# EAGLE design THTfeather (EAGLE 7.6.0)
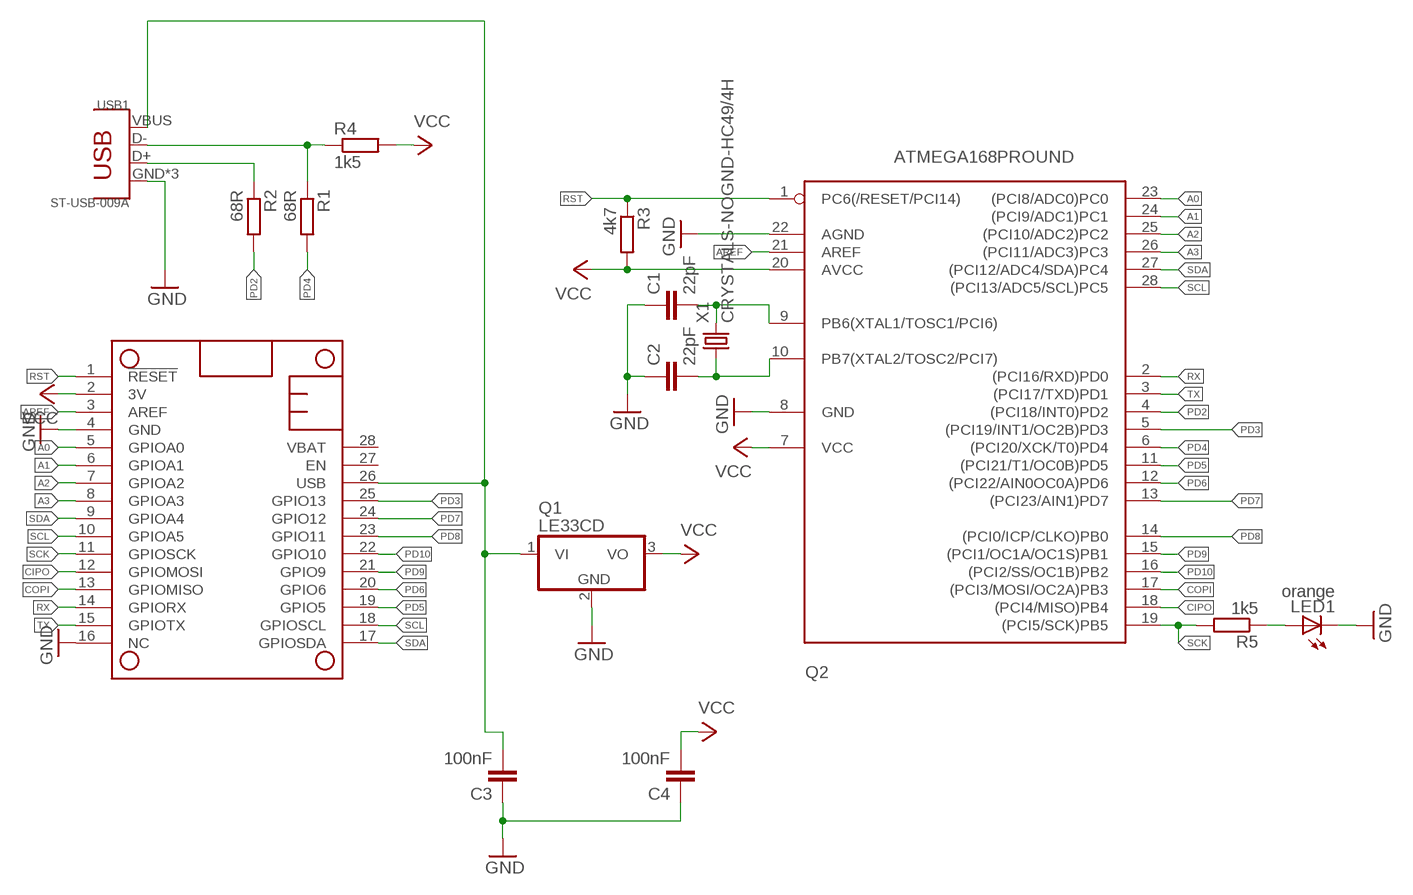
[diagram p0: schematic, sheet 1]

## Parts
C1  22pF  C-EU025-025X050  [C025-025X050]
C2  22pF  C-EU025-025X050  [C025-025X050]
C3  100nF  C-EU025-025X050  [C025-025X050]
C4  100nF  C-EU025-025X050  [C025-025X050]
LED1  orange  LED3MM  [LED3MM]
MS1  FEATHERWING_NODIM  [FEATHERWING_DIM]
Q1  LE33CD  78L33  [TO92]
Q2  ATMEGA168PROUND  [DIL28-3-ROUND]
R1  68R  R-EU_0204/5  [0204/5]
R2  68R  R-EU_0204/5  [0204/5]
R3  4k7  R-EU_0204/5  [0204/5]
R4  1k5  R-EU_0204/5  [0204/5]
R5  1k5  R-EU_0204/5  [0204/5]
USB1  ST-USB-009A  DIP-USB-B-TYPE-FMAL(4+2P-2.5-90D)  [USB4+2-2.5-90D]
X1  CRYSTALS-NOGND-HC49/4H  [HC49]

## Nets
A0: MS1.5(GPIOA0) Q2.23((PCI8/ADC0)PC0)
A1: MS1.6(GPIOA1) Q2.24((PCI9/ADC1)PC1)
A2: MS1.7(GPIOA2) Q2.25((PCI10/ADC2)PC2)
A3: MS1.8(GPIOA3) Q2.26((PCI11/ADC3)PC3)
AREF: MS1.3(AREF) Q2.21(AREF)
CIPO: MS1.12(GPIOMOSI) Q2.18((PCI4/MISO)PB4)
COPI: MS1.13(GPIOMISO) Q2.17((PCI3/MOSI/OC2A)PB3)
GND: C1.1 C2.1 C3.1 C4.1 LED1.K(C) MS1.4(GND) MS1.16(NC) Q1.2(GND) Q2.8(GND) Q2.22(AGND) USB1.GND USB1.S1 USB1.S2
N$1: C1.2 Q2.9(PB6(XTAL1/TOSC1/PCI6)) X1.2
N$2: C2.2 Q2.10(PB7(XTAL2/TOSC2/PCI7)) X1.1
N$4: LED1.A R5.1
N$5: R1.1 R4.1 USB1.D-
N$6: R2.1 USB1.D+
PD2: Q2.4((PCI18/INT0)PD2) R2.2
PD3: MS1.25(GPIO13) Q2.5((PCI19/INT1/OC2B)PD3)
PD4: Q2.6((PCI20/XCK/T0)PD4) R1.2
PD5: MS1.19(GPIO5) Q2.11((PCI21/T1/OC0B)PD5)
PD6: MS1.20(GPIO6) Q2.12((PCI22/AIN0OC0A)PD6)
PD7: MS1.24(GPIO12) Q2.13((PCI23/AIN1)PD7)
PD8: MS1.23(GPIO11) Q2.14((PCI0/ICP/CLKO)PB0)
PD9: MS1.21(GPIO9) Q2.15((PCI1/OC1A/OC1S)PB1)
PD10: MS1.22(GPIO10) Q2.16((PCI2/SS/OC1B)PB2)
RST: MS1.1(!RESET) Q2.1(PC6(/RESET/PCI14)) R3.1
RX: MS1.14(GPIORX) Q2.2((PCI16/RXD)PD0)
SCK: MS1.11(GPIOSCK) Q2.19((PCI5/SCK)PB5) R5.2
SCL: MS1.10(GPIOA5) MS1.18(GPIOSCL) Q2.28((PCI13/ADC5/SCL)PC5)
SDA: MS1.9(GPIOA4) MS1.17(GPIOSDA) Q2.27((PCI12/ADC4/SDA)PC4)
TX: MS1.15(GPIOTX) Q2.3((PCI17/TXD)PD1)
USB: C3.2 MS1.26(USB) Q1.1(VI) USB1.VBUS
VCC: C4.2 MS1.2(3V) Q1.3(VO) Q2.7(VCC) Q2.20(AVCC) R3.2 R4.2
Unconnected: MS1.27(EN) MS1.28(VBAT)

## Library data of the parts
C1-C4 = rcl:C-EU: CAPACITOR, European symbol
LED1 = led:LED: LED OSRAM: - CHIPLED LG R971, LG N971, LY N971, LG Q971, LY Q971, LO R971, LY R971 LH N974, LH R974 LS Q976, LO Q976, LY Q976 LO Q996 - Hyper CHIPLED LW Q18S LB Q993, LB Q99A, LB R99A - SideLED LS A670, LO A670, LY A670, LG A670, LP A670 LB A673, LV A673, LT A673, LW A673 LH A674 LY A675 LS A676, LA A676, LO A676, LY A676, LW A676 LS A679, LY A679, LG A679 - Hyper Micro SIDELED® LS Y876, LA Y876, LO Y876, LY Y876 LT Y87S - SmartLED LW L88C, LW L88S LB L89C, LB L89S, LG L890 LS L89K, LO L89K, LY L89K LS L896, LA L896, LO L896, LY L896 - TOPLED LS T670, LO T670, LY T670, LG T670, LP T670 LSG T670, LSP T670, LSY T670, LOP T670, LYG T670 LG T671, LOG T671, LSG T671 LB T673, LV T673, LT T673, LW T673 LH T674 LS T676, LA T676, LO T676, LY T676, LB T676, LH T676, LSB T676, LW T676 LB T67C, LV T67C, LT T67C, LS T67K, LO T67K, LY T67K, LW E67C LS E67B, LA E67B, LO E67B, LY E67B, LB E67C, LV E67C, LT E67C LW T67C LS T679, LY T679, LG T679 LS T770, LO T770, LY T770, LG T770, LP T770 LB T773, LV T773, LT T773, LW T773 LH T774 LS E675, LA E675, LY E675, LS T675 LS T776, LA T776, LO T776, LY T776, LB T776 LHGB T686 LT T68C, LB T68C - Hyper Mini TOPLED® LB M676 - Mini TOPLED Santana® LG M470 LS M47K, LO M47K, LY M47K Source: http://www.osram.convergy.de LUXEON: - LUMILED® LXK2-PW12-R00, LXK2-PW12-S00, LXK2-PW14-U00, LXK2-PW14-V00 LXK2-PM12-R00, LXK2-PM12-S00, LXK2-PM14-U00 LXK2-PE12-Q00, LXK2-PE12-R00, LXK2-PE12-S00, LXK2-PE14-T00, LXK2-PE14-U00 LXK2-PB12-K00, LXK2-PB12-L00, LXK2-PB12-M00, LXK2-PB14-N00, LXK2-PB14-P00, LXK2-PB14-Q00 LXK2-PR12-L00, LXK2-PR12-M00, LXK2-PR14-Q00, LXK2-PR14-R00 LXK2-PD12-Q00, LXK2-PD12-R00, LXK2-PD12-S00 LXK2-PH12-R00, LXK2-PH12-S00 LXK2-PL12-P00, LXK2-PL12-Q00, LXK2-PL12-R00 Source: www.luxeon.com KINGBRIGHT: KA-3528ASYC Source: www.kingbright.com
MS1 = adafruit:FEATHERWING
Q1 = adafruit:78L33
Q2 = adafruit:ATMEGA168*P: MICROCONTROLLER 16 kBytes FLASH 1 kBytes SRAM 512 Bytes EEPROM USART 8-channel 10 bit ADC
R1-R5 = rcl:R-EU_: RESISTOR, European symbol
USB1 = Seeed-OPL-Connector:DIP-USB-B-TYPE-FMAL(4+2P-2.5-90D): 320010018; MPN: ST-USB-009A
X1 = IQD-Frequency-Products:CRYSTALS-NOGND: CRYSTALS CAN NOT GROUNDED

## Board
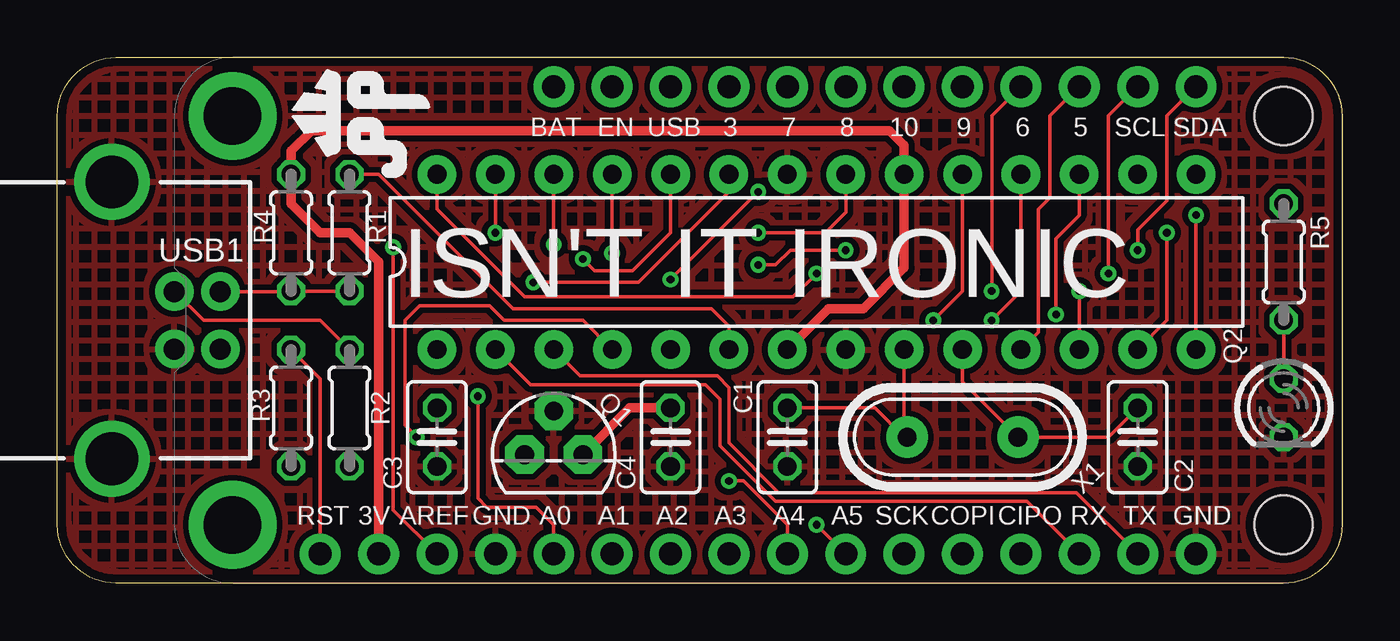
[diagram p1: board, top side]
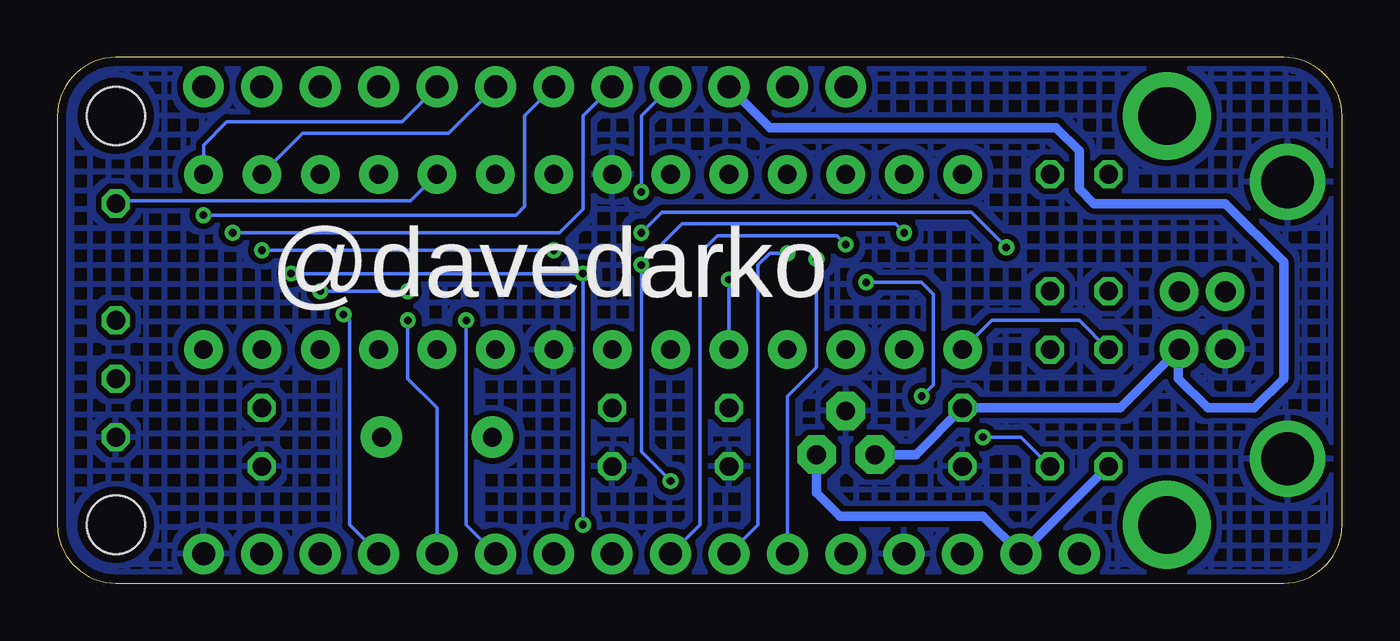
[diagram p2: board, bottom side, seen from below]

Size 55.88 x 22.86 mm. Coordinates in mm from the lower left corner, seen from the top.
Outline: 55.88,20.32 55.88,2.54 arc-90 53.34,0 2.54,0 arc-90 0,2.54 0,20.32 arc-90 2.54,22.86 53.34,22.86 arc-90 55.88,20.32
Copper layers (1*16): Top 0.0356mm / dielectric 1.5011mm / Bottom 0.0356mm
Design rules "LaenPCBOrder *": minimum track width 6mil, minimum drill 13mil, track to track 6mil, track to pad 6mil, pad to pad 6mil, via to via 6mil, smd to smd 6mil, copper to edge 15mil, drill to drill 6mil, minimum pad ring 7mil, minimum via ring 7mil, stop-mask expansion 3mil, vias tented up to drill 200mil, thermal gap 10mil

### Footprints (pad centres in the part's own frame; a part is rotated, then mirrored left to right if it is on the bottom)
C025-025X050 = drill 0.813 octagon: 1 -1.27,0; 2 1.27,0
LED3MM = drill 0.813 octagon: A -1.27,0; K 1.27,0
FEATHERWING_DIM = drill 1 pad 1.778: 1 6.35,1.27; 2 8.89,1.27; 3 11.43,1.27; 4 13.97,1.27; 5 16.51,1.27; 6 19.05,1.27; 7 21.59,1.27; 8 24.13,1.27; 9 26.67,1.27; 10 29.21,1.27; 11 31.75,1.27; 12 34.29,1.27; 13 36.83,1.27; 14 39.37,1.27; 15 41.91,1.27; 16 44.45,1.27; 17 44.45,21.59; 18 41.91,21.59; 19 39.37,21.59; 20 36.83,21.59; 21 34.29,21.59; 22 31.75,21.59; 23 29.21,21.59; 24 26.67,21.59; 25 24.13,21.59; 26 21.59,21.59; 27 19.05,21.59; 28 16.51,21.59 | drill 2.5 pad 3.81: P$1 2.54,20.32; P$2 2.54,2.54 | hole 2.54: 48.26,20.32; 48.26,2.54
TO92 = drill 0.813 pad 1.676 octagon: 1 -1.27,0; 2 0,1.905; 3 1.27,0
DIL28-3-ROUND = drill 0.813 pad 1.676: 1 -16.51,-3.81; 2 -13.97,-3.81; 3 -11.43,-3.81; 4 -8.89,-3.81; 5 -6.35,-3.81; 6 -3.81,-3.81; 7 -1.27,-3.81; 8 1.27,-3.81; 9 3.81,-3.81; 10 6.35,-3.81; 11 8.89,-3.81; 12 11.43,-3.81; 13 13.97,-3.81; 14 16.51,-3.81; 15 16.51,3.81; 16 13.97,3.81; 17 11.43,3.81; 18 8.89,3.81; 19 6.35,3.81; 20 3.81,3.81; 21 1.27,3.81; 22 -1.27,3.81; 23 -3.81,3.81; 24 -6.35,3.81; 25 -8.89,3.81; 26 -11.43,3.81; 27 -13.97,3.81; 28 -16.51,3.81
0204/5 = drill 0.813 octagon: 1 -2.54,0; 2 2.54,0
USB4+2-2.5-90D = drill 0.914 pad 1.676: D+ 0,1.25; D- 2,1.25; GND 0,-1.25; VBUS 2,-1.25 | drill 2.286: S1 -2.71,-6.02; S2 -2.71,6.02
HC49 = drill 0.813 pad 1.8: 1 -2.413,0; 2 2.413,0

### Placement (x,y rotation side)
C1  31.75,6.35 90 top
C2  46.99,6.35 90 top
C3  16.51,6.35 90 top
C4  26.67,6.35 90 top
LED1  53.34,7.62 270 top
MS1  5.08,0 0 top
Q1  21.59,5.59 0 top
Q2  33.02,13.97 0 top
R1  12.7,15.24 90 top
R2  12.7,7.62 270 top
R3  10.16,7.62 270 top
R4  10.16,15.24 90 top
R5  53.34,13.97 90 top
U$1  [DAVEDARKO2_LOGO]  12.45,20.45 270 top
USB1  5.08,11.43 0 top
X1  39.37,6.35 180 top

### Tracks (layer width: path | path; a pad name or v marks a point on that pad's centre or on a via)
A0  (via drill 0.33)
  Top 0.152: v20.7,13.08 25.27,13.08 29.21,17.02 Q2.23 | v18.29,8.13 18.29,3.68 18.67,3.3 20.83,3.3 21.59,2.54 MS1.5
  Bottom 0.152: v20.7,13.08 18.29,13.08 17.78,12.57 17.78,8.64 v18.29,8.13
A1  (via drill 0.33)
  Top 0.152: Q2.24 26.67,15.24 25.02,13.59 23.37,13.59 v22.86,14.1
  Bottom 0.152: v22.86,14.1 22.86,9.4 24.13,8.13 MS1.6
A2  (via drill 0.33)
  Top 0.152: Q2.25 v24.13,14.35
  Bottom 0.152: v24.13,14.35 24.89,14.35 25.4,13.84 25.4,2.54 MS1.7
A3  (via drill 0.33)
  Top 0.152: Q2.26 v21.59,14.73
  Bottom 0.152: v21.59,14.73 21.97,15.11 27.18,15.11 27.94,14.35 27.94,2.54 MS1.8
AREF  (via drill 0.33)
  Top 0.152: MS1.3 14.61,3.17 v14.61,14.61 | v30.48,15.24 33.4,15.24 34.29,16.13 Q2.21
  Bottom 0.152: v14.61,14.61 16.13,16.13 29.59,16.13 v30.48,15.24
CIPO  (via drill 0.33)
  Top 0.152: Q2.18 41.91,12.7 v40.64,11.43
  Bottom 0.152: v40.64,11.43 40.64,8.89 39.37,7.62 MS1.12
COPI  (via drill 0.33)
  Top 0.152: Q2.17 44.45,16 43.43,14.99 v43.43,11.68
  Bottom 0.152: v43.43,11.68 43.18,11.43 43.18,2.54 MS1.13
GND
  pour Top (isolate 0.254, hatched): 0,25.4 58.42,25.4 58.42,-2.54 0,-2.54
  pour Bottom (isolate 0.254, hatched): -1.27,24.13 57.15,24.13 57.15,-1.27 -1.27,-1.27
N$1
  Top 0.152: C1.2 35.56,7.62 36.83,6.35 | 36.83,6.35 Q2.9 | X1.2 36.83,6.35
N$2
  Top 0.152: Q2.10 39.37,8.76 X1.1 45.72,6.35 C2.2
N$4
  Top 0.152: R5.1 LED1.A
N$5
  Top 0.152: USB1.D- 10.14,12.68 R4.1 R1.1
N$6
  Top 0.152: USB1.D+ 5.1,12.68 6.35,11.43 11.43,11.43 R2.1
PD2  (via drill 0.33)
  Top 0.152: Q2.4 22.86,11.43 19.43,11.43 18.8,12.06 15.75,12.06 15.11,11.43 15.11,6.86 v15.62,6.35
  Bottom 0.152: v15.62,6.35 13.97,6.35 R2.2
PD3  (via drill 0.33)
  Top 0.152: v30.48,17.02 v26.67,13.21
  Bottom 0.152: MS1.25 30.48,20.32 v30.48,17.02 | v26.67,13.21 Q2.5
PD4
  Top 0.152: Q2.6 29.21,11.18 28.45,11.94 19.81,11.94 13.97,17.78 R1.2
PD5
  Top 0.152: MS1.19 43.18,20.32 43.18,16.76 42.67,16.26 42.67,10.92 Q2.11
PD6  (via drill 0.33)
  Top 0.152: MS1.20 40.64,20.32 v40.64,12.7 | v44.45,12.7 Q2.12
  Bottom 0.152: v40.64,12.7 v44.45,12.7
PD7  (via drill 0.33)
  Top 0.152: v48.26,15.24 48.26,11.43 Q2.13
  Bottom 0.152: MS1.24 33.02,20.32 33.02,16.26 34.04,15.24 v48.26,15.24
PD8  (via drill 0.33)
  Top 0.152: v49.53,16 Q2.14
  Bottom 0.152: MS1.23 35.56,20.32 35.56,16.38 35.94,16 v49.53,16
PD9
  Bottom 0.152: Q2.15 49.53,19.05 48.51,20.07 40.89,20.07 MS1.21
PD10
  Bottom 0.152: Q2.16 45.21,19.56 38.86,19.56 MS1.22
RST
  Top 0.152: MS1.1 11.43,8.89 R3.1
  Bottom 0.152: Q2.1 15.24,11.43 11.43,11.43 R3.1
RX
  Top 0.152: Q2.2 20.57,8.64 28.19,8.64 28.83,8 28.83,5.97 31.24,3.56 42.16,3.56 MS1.14
SCK  (via drill 0.33)
  Top 0.152: Q2.19 39.37,12.7 v38.1,11.43
  Bottom 0.152: v38.1,11.43 38.1,2.54 MS1.11 | Q2.19 40.51,16.64 53.21,16.64 R5.2
SCL  (via drill 0.33)
  Top 0.152: Q2.28 16.51,16.26 20.32,12.45 32,12.45 v33.02,13.46 | v33.02,2.54 MS1.10 | MS1.18 45.72,20.32 v45.72,13.46
  Bottom 0.152: v33.02,2.54 v33.02,13.46 v45.72,13.46
SDA  (via drill 0.33)
  Top 0.152: Q2.27 v19.05,15.24 | v29.21,4.45 29.84,4.45 31.75,2.54 MS1.9 | MS1.17 48.26,20.32 48.26,16.64 46.99,15.37 v46.99,14.48 | v30.48,13.84 31.24,13.84 31.88,14.48 v34.29,14.48
  Bottom 0.152: v19.05,15.24 19.43,15.62 28.7,15.62 v30.48,13.84 30.48,5.71 v29.21,4.45 | v46.99,14.48 v34.29,14.48
TX
  Top 0.152: Q2.3 22.73,9.02 28.7,9.02 29.21,8.51 29.21,6.1 31.37,3.94 44.32,3.94 MS1.15
USB
  Bottom 0.406: MS1.26 24.89,19.81 12.45,19.81 11.43,18.8 11.43,17.14 10.79,16.51 5.08,16.51 2.54,13.97 2.54,8.89 3.81,7.62 5.84,7.62 7.11,8.89 7.11,10.15 USB1.VBUS 7.09,10.18 9.65,7.62 C3.2 18.54,5.59 Q1.1
VCC
  Top 0.406: Q2.7 33.53,11.94 35.05,11.94 36.83,13.72 Q2.20 36.83,19.05 36.2,19.68 11.05,19.68 10.16,18.8 R4.2 10.16,16.51 11.43,15.24 12.7,15.24 13.97,13.97 MS1.2 | Q1.3 24.89,7.62 C4.2
  Bottom 0.406: Q1.3 22.86,3.94 21.84,2.92 15.62,2.92 MS1.2 R3.2

### Text on the board
tNames: BAT | EN | USB | 3 | 7 | 8 | 10 | 9 | 6 | 5 | SCL | SDA | ISN'T IT IRONIC | RST | 3V | AREF | GND | A0 | A1 | A2 | A3 | A4 | A5 | SCK | COPI | CIPO | RX | TX | GND
bNames: @davedarko